# EAGLE design miniDCU (EAGLE 9.6.2)
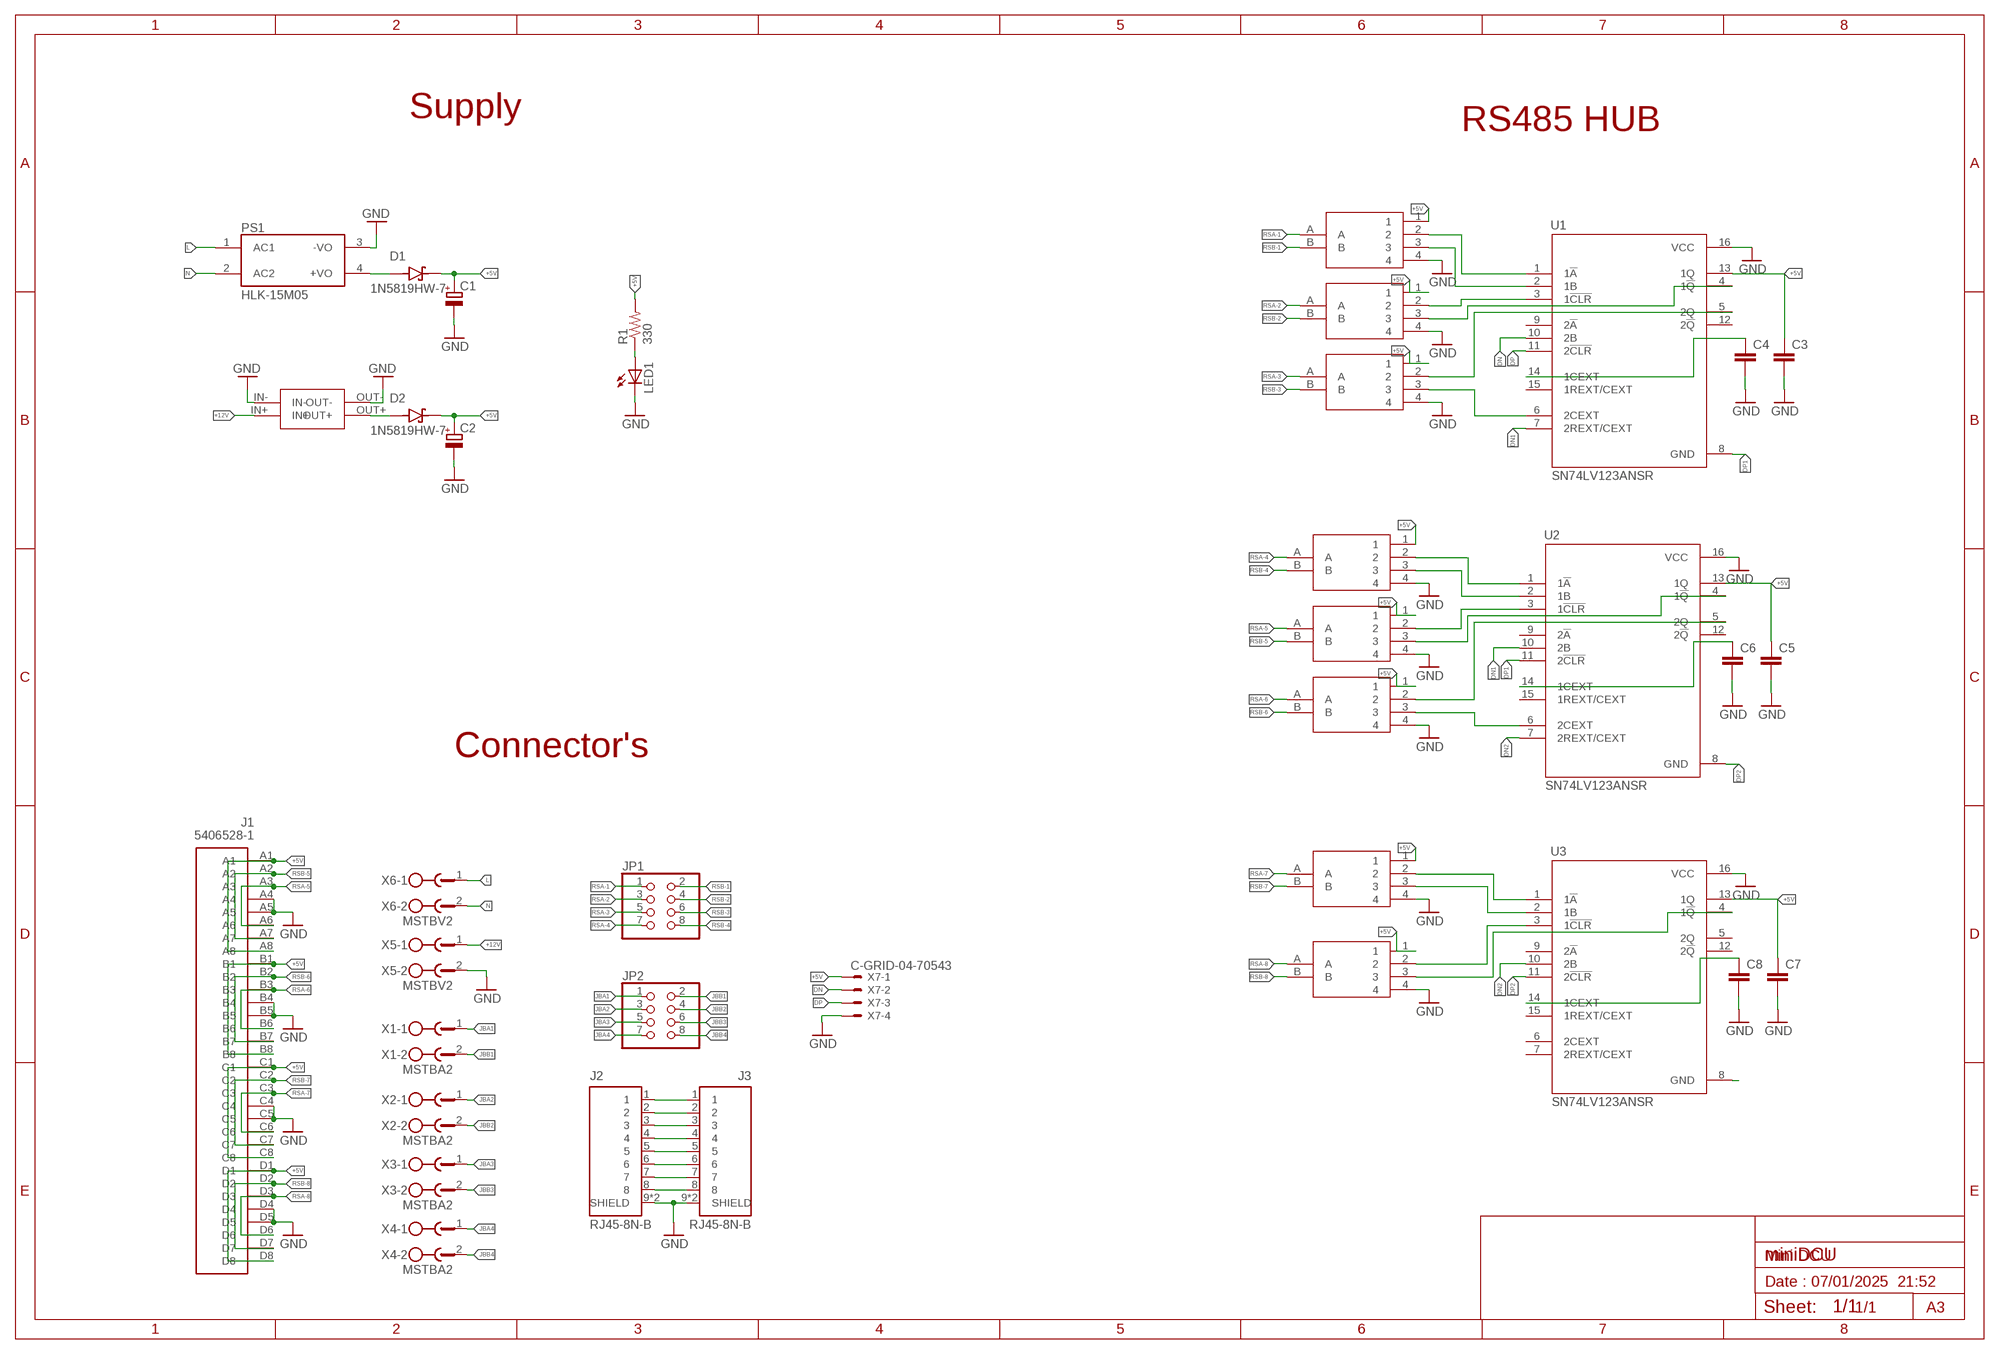
[diagram p0: schematic, sheet 1]

## Parts
C1  CPOL-EU153CLV-0505  [153CLV-0505]
C2  CPOL-EU153CLV-0505  [153CLV-0505]
C3  C-EUC0603K  [C0603K]
C4  C-EUC0603K  [C0603K]
C5  C-EUC0603K  [C0603K]
C6  C-EUC0603K  [C0603K]
C7  C-EUC0603K  [C0603K]
C8  C-EUC0603K  [C0603K]
D1  1N5819HW-7  [SOD3715X145N]
D2  1N5819HW-7  [SOD3715X145N]
J1  5406528-1  [5406528-1]
J2  RJ45-8N-B  [TE_RJ45-8N-B]
J3  RJ45-8N-B  [TE_RJ45-8N-B]
JP1  PINHD-2X4  [2X04]
JP2  PINHD-2X4  [2X04]
LED1  LED3MM  [LED3MM]
MINI1  MINI360  [MINI360]
PS1  HLK-15M05  [CONV_HLK-15M05]
R1  330  R-US_M0805  [M0805]
U1  SN74LV123ANSR  [SOIC127P780X200-16N]
U2  SN74LV123ANSR  [SOIC127P780X200-16N]
U3  SN74LV123ANSR  [SOIC127P780X200-16N]
USB2RS1  USB2RS485  [USB2RS485]
USB2RS2  USB2RS485  [USB2RS485]
USB2RS3  USB2RS485  [USB2RS485]
USB2RS4  USB2RS485  [USB2RS485]
USB2RS5  USB2RS485  [USB2RS485]
USB2RS6  USB2RS485  [USB2RS485]
USB2RS7  USB2RS485  [USB2RS485]
USB2RS8  USB2RS485  [USB2RS485]
X1  MSTBA2  [MSTBA2]
X2  MSTBA2  [MSTBA2]
X3  MSTBA2  [MSTBA2]
X4  MSTBA2  [MSTBA2]
X5  MSTBV2  [MSTBV2]
X6  MSTBV2  [MSTBV2]
X7  C-GRID-04-70543  [70543-04]

## Nets
+5V: C1.+ C2.+ C3.1 C5.1 C7.1 D1.C(K) D2.C(K) J1.A1 J1.A8 J1.B1 J1.B8 J1.C1 J1.C8 J1.D1 J1.D8 R1.2 U1.13(1Q) U2.13(1Q) U3.13(1Q) USB2RS1.1 USB2RS2.1 USB2RS3.1 USB2RS4.1 USB2RS5.1 USB2RS6.1 USB2RS7.1 USB2RS8.1 X7.1
+12V: MINI1.IN+ X5.1
DN: U1.10(2B) X7.2
DN1: U1.7(2REXT/CEXT) U2.10(2B)
DN2: U2.7(2REXT/CEXT) U3.10(2B)
DP: U1.11(2!CLR) X7.3
DP1: U1.8(GND) U2.11(2!CLR)
DP2: U2.8(GND) U3.11(2!CLR)
GND: C1.- C2.- C3.2 C4.2 C5.2 C6.2 C7.2 C8.2 J1.A4 J1.A5 J1.B4 J1.B5 J1.C4 J1.C5 J1.D4 J1.D5 J2.9(SHIELD) J2.10(SHIELD) J3.9(SHIELD) J3.10(SHIELD) LED1.K(C) MINI1.IN- MINI1.OUT- PS1.3(-VO) U1.16(VCC) U2.16(VCC) U3.16(VCC) USB2RS1.4 USB2RS2.4 USB2RS3.4 USB2RS4.4 USB2RS5.4 USB2RS6.4 USB2RS7.4 USB2RS8.4 X5.2 X7.4
JBA1: JP2.1 X1.1
JBA2: JP2.3 X2.1
JBA3: JP2.5 X3.1
JBA4: JP2.7 X4.1
JBB1: JP2.2 X1.2
JBB2: JP2.4 X2.2
JBB3: JP2.6 X3.2
JBB4: JP2.8 X4.2
L: PS1.1(AC1) X6.1
N: PS1.2(AC2) X6.2
N$1: D1.A PS1.4(+VO)
N$2: J2.1 J3.1
N$3: D2.A MINI1.OUT+
N$4: J2.2 J3.2
N$5: J2.3 J3.3
N$6: J2.4 J3.4
N$7: LED1.A R1.1
N$9: J2.5 J3.5
N$10: J2.6 J3.6
N$11: J2.7 J3.7
N$12: J2.8 J3.8
N$13: U3.8(GND)
N$21: U1.1(1!A) USB2RS1.2
N$22: U1.2(1B) USB2RS1.3
N$23: U1.3(1!CLR) USB2RS2.2
N$24: U1.4(1!Q) USB2RS2.3
N$25: U1.5(2Q) USB2RS3.2
N$26: U1.6(2CEXT) USB2RS3.3
N$35: U2.1(1!A) USB2RS5.2
N$36: U2.2(1B) USB2RS5.3
N$37: U2.3(1!CLR) USB2RS6.2
N$38: U2.4(1!Q) USB2RS6.3
N$39: U2.5(2Q) USB2RS7.2
N$40: U2.6(2CEXT) USB2RS7.3
N$49: U3.1(1!A) USB2RS4.2
N$50: U3.2(1B) USB2RS4.3
N$51: U3.3(1!CLR) USB2RS8.2
N$52: U3.4(1!Q) USB2RS8.3
N$54: C4.1 U1.14(1CEXT)
N$55: C8.1 U3.14(1CEXT)
N$61: C6.1 U2.14(1CEXT)
RSA-1: JP1.1 USB2RS1.A
RSA-2: JP1.3 USB2RS2.A
RSA-3: JP1.5 USB2RS3.A
RSA-4: JP1.7 USB2RS5.A
RSA-5: J1.A3 J1.A6 USB2RS6.A
RSA-6: J1.B3 J1.B6 USB2RS7.A
RSA-7: J1.C3 J1.C6 USB2RS4.A
RSA-8: J1.D3 J1.D6 USB2RS8.A
RSB-1: JP1.2 USB2RS1.B
RSB-2: JP1.4 USB2RS2.B
RSB-3: JP1.6 USB2RS3.B
RSB-4: JP1.8 USB2RS5.B
RSB-5: J1.A2 J1.A7 USB2RS6.B
RSB-6: J1.B2 J1.B7 USB2RS7.B
RSB-7: J1.C2 J1.C7 USB2RS4.B
RSB-8: J1.D2 J1.D7 USB2RS8.B
Unconnected: U1.9(2!A) U1.12(2!Q) U1.15(1REXT/CEXT) U2.9(2!A) U2.12(2!Q) U2.15(1REXT/CEXT) U3.5(2Q) U3.6(2CEXT) U3.7(2REXT/CEXT) U3.9(2!A) U3.12(2!Q) U3.15(1REXT/CEXT)

## Notes on the sheet
- Supply
- RS485 HUB
- Connector's
- Mini DCU
- Date : 07/01/2025  21:52
- 1/1 | A3

## Library data of the parts
C1 C2 = rcl:CPOL-EU: POLARIZED CAPACITOR, European symbol; SPICEPREFIX: C
C3-C8 = rcl:C-EU: CAPACITOR, European symbol; SPICEPREFIX: C
D1 D2 = 1N5819HW-7:1N5819HW-7: 1N5819HW Series 40 V 1 A Surface Mount Schottky Barrier Rectifier - SOD-123 Check availability <https://pricing.snapeda.com/parts/1N5819HW-7/Diodes%20Inc./view-part?ref=eda>; AVAILABILITY: In Stock; DESCRIPTION: Diode Schottky 40 V 1A Surface Mount SOD-123; MF: Diodes Inc.; MP: 1N5819HW-7; PACKAGE: SOD-123 Fairchild Semiconductor; PRICE: None; PURCHASE-URL: https://pricing.snapeda.com/search/part/1N5819HW-7/?ref=eda
J1 = 1x4-rj45:5406528-1: https://www.mouser.com/ProductDetail/TE-Connectivity/5406528-1?qs=%2Fha2pyFaduhW1yoX2fqnO8wde0gPlB9ihmIbWroxuIA%3D Check availability <https://pricing.snapeda.com/parts/5406528-1/TE%20Connectivity/view-part?ref=eda>; AVAILABILITY: In Stock; CHECK_PRICES: https://www.snapeda.com/parts/5406528-1/TE+Connectivity+AMP+Connectors/view-part/?ref=eda; COMMENT: 5406528-1; DESCRIPTION: Conn RJ-45 F 32 POS 2.04mm Solder RA Thru-Hole 32 Terminal 4 Port Tray Cat 5; EU_ROHS_COMPLIANCE: Compliant; MF: TE Connectivity; MP: 5406528-1; PACKAGE: None; PRICE: None; SNAPEDA_LINK: https://www.snapeda.com/parts/5406528-1/TE+Connectivity+AMP+Connectors/view-part/?ref=snap
J2 J3 = RJ45-8N-B:RJ45-8N-B: RJ Jack / Signal Line EMI/RFI Filters 6 TERM LOW PROFILE BLOCK INDUCTOR 8 PIN Check availability <https://pricing.snapeda.com/parts/RJ45-8N-B/TE%20Connectivity/view-part?ref=eda>; AVAILABILITY: In Stock; DESCRIPTION: Jack Modular Connector 8p8c (RJ45, Ethernet) 90° Angle (Right) Unshielded -; MF: TE Connectivity; MP: RJ45-8N-B; PACKAGE: None; PRICE: None; PURCHASE-URL: https://pricing.snapeda.com/search/part/RJ45-8N-B/?ref=eda
JP1 JP2 = pinhead:PINHD-2X4: PIN HEADER
LED1 = adafruit:LED: LED OSRAM: - CHIPLED LG R971, LG N971, LY N971, LG Q971, LY Q971, LO R971, LY R971 LH N974, LH R974 LS Q976, LO Q976, LY Q976 LO Q996 - Hyper CHIPLED LW Q18S LB Q993, LB Q99A, LB R99A - SideLED LS A670, LO A670, LY A670, LG A670, LP A670 LB A673, LV A673, LT A673, LW A673 LH A674 LY A675 LS A676, LA A676, LO A676, LY A676, LW A676 LS A679, LY A679, LG A679 - Hyper Micro SIDELED® LS Y876, LA Y876, LO Y876, LY Y876 LT Y87S - SmartLED LW L88C, LW L88S LB L89C, LB L89S, LG L890 LS L89K, LO L89K, LY L89K LS L896, LA L896, LO L896, LY L896 - TOPLED LS T670, LO T670, LY T670, LG T670, LP T670 LSG T670, LSP T670, LSY T670, LOP T670, LYG T670 LG T671, LOG T671, LSG T671 LB T673, LV T673, LT T673, LW T673 LH T674 LS T676, LA T676, LO T676, LY T676, LB T676, LH T676, LSB T676, LW T676 LB T67C, LV T67C, LT T67C, LS T67K, LO T67K, LY T67K, LW E67C LS E67B, LA E67B, LO E67B, LY E67B, LB E67C, LV E67C, LT E67C LW T67C LS T679, LY T679, LG T679 LS T770, LO T770, LY T770, LG T770, LP T770 LB T773, LV T773, LT T773, LW T773 LH T774 LS E675, LA E675, LY E675, LS T675 LS T776, LA T776, LO T776, LY T776, LB T776 LHGB T686 LT T68C, LB T68C - Hyper Mini TOPLED® LB M676 - Mini TOPLED Santana® LG M470 LS M47K, LO M47K, LY M47K Source: http://www.osram.convergy.de/
MINI1 = mini360:MINI360
PS1 = HLK-15M05:HLK-15M05: Check availability <https://pricing.snapeda.com/parts/HLK-10M12/Hi-link/view-part?ref=eda>; AVAILABILITY: Not in stock; CHECK_PRICES: https://www.snapeda.com/parts/HLK-10M12/Hi-link/view-part/?ref=eda; DESCRIPTION: 10W Ultra-Compact Power Module; MF: Hi-link; MP: HLK-10M12; PACKAGE: Package; PRICE: None; SNAPEDA_LINK: https://www.snapeda.com/parts/HLK-10M12/Hi-link/view-part/?ref=snap
R1 = adafruit:R-US_: RESISTOR, American symbol
U1-U3 = SN74LV123ANSR:SN74LV123ANSR: Monostable Multivibrator 13ns 16-SO; CHECK_PRICES: https://www.snapeda.com/parts/SN74LV123ANSR/Texas+Instruments/view-part/?ref=eda; DESCRIPTION: Dual Retriggerable Monostable Multivibrators; DIGIKEY_PART_NUMBER: 296-46201-2-ND; MF: Texas Instruments; MP: SN74LV123ANSR; PACKAGE: SOP-16 Texas Instruments; SNAPEDA_LINK: https://www.snapeda.com/parts/SN74LV123ANSR/Texas+Instruments/view-part/?ref=snap
USB2RS1-USB2RS8 = USB2RS485:USB2RS485
X1-X4 = con-phoenix-508:MSTBA2: PHOENIX; MF: FARNELL; MPN: 1757242; OC_FARNELL: 3705171; OC_NEWARK: 71C4161
X5 X6 = con-phoenix-508:MSTBV2: PHOENIX
X7 = con-molex:C-GRID-04: CONNECTOR wire to board 2.54 mm (0.100") pitch header; MF: MOLEX; OC_FARNELL: unknown; OC_NEWARK: unknown

## Board
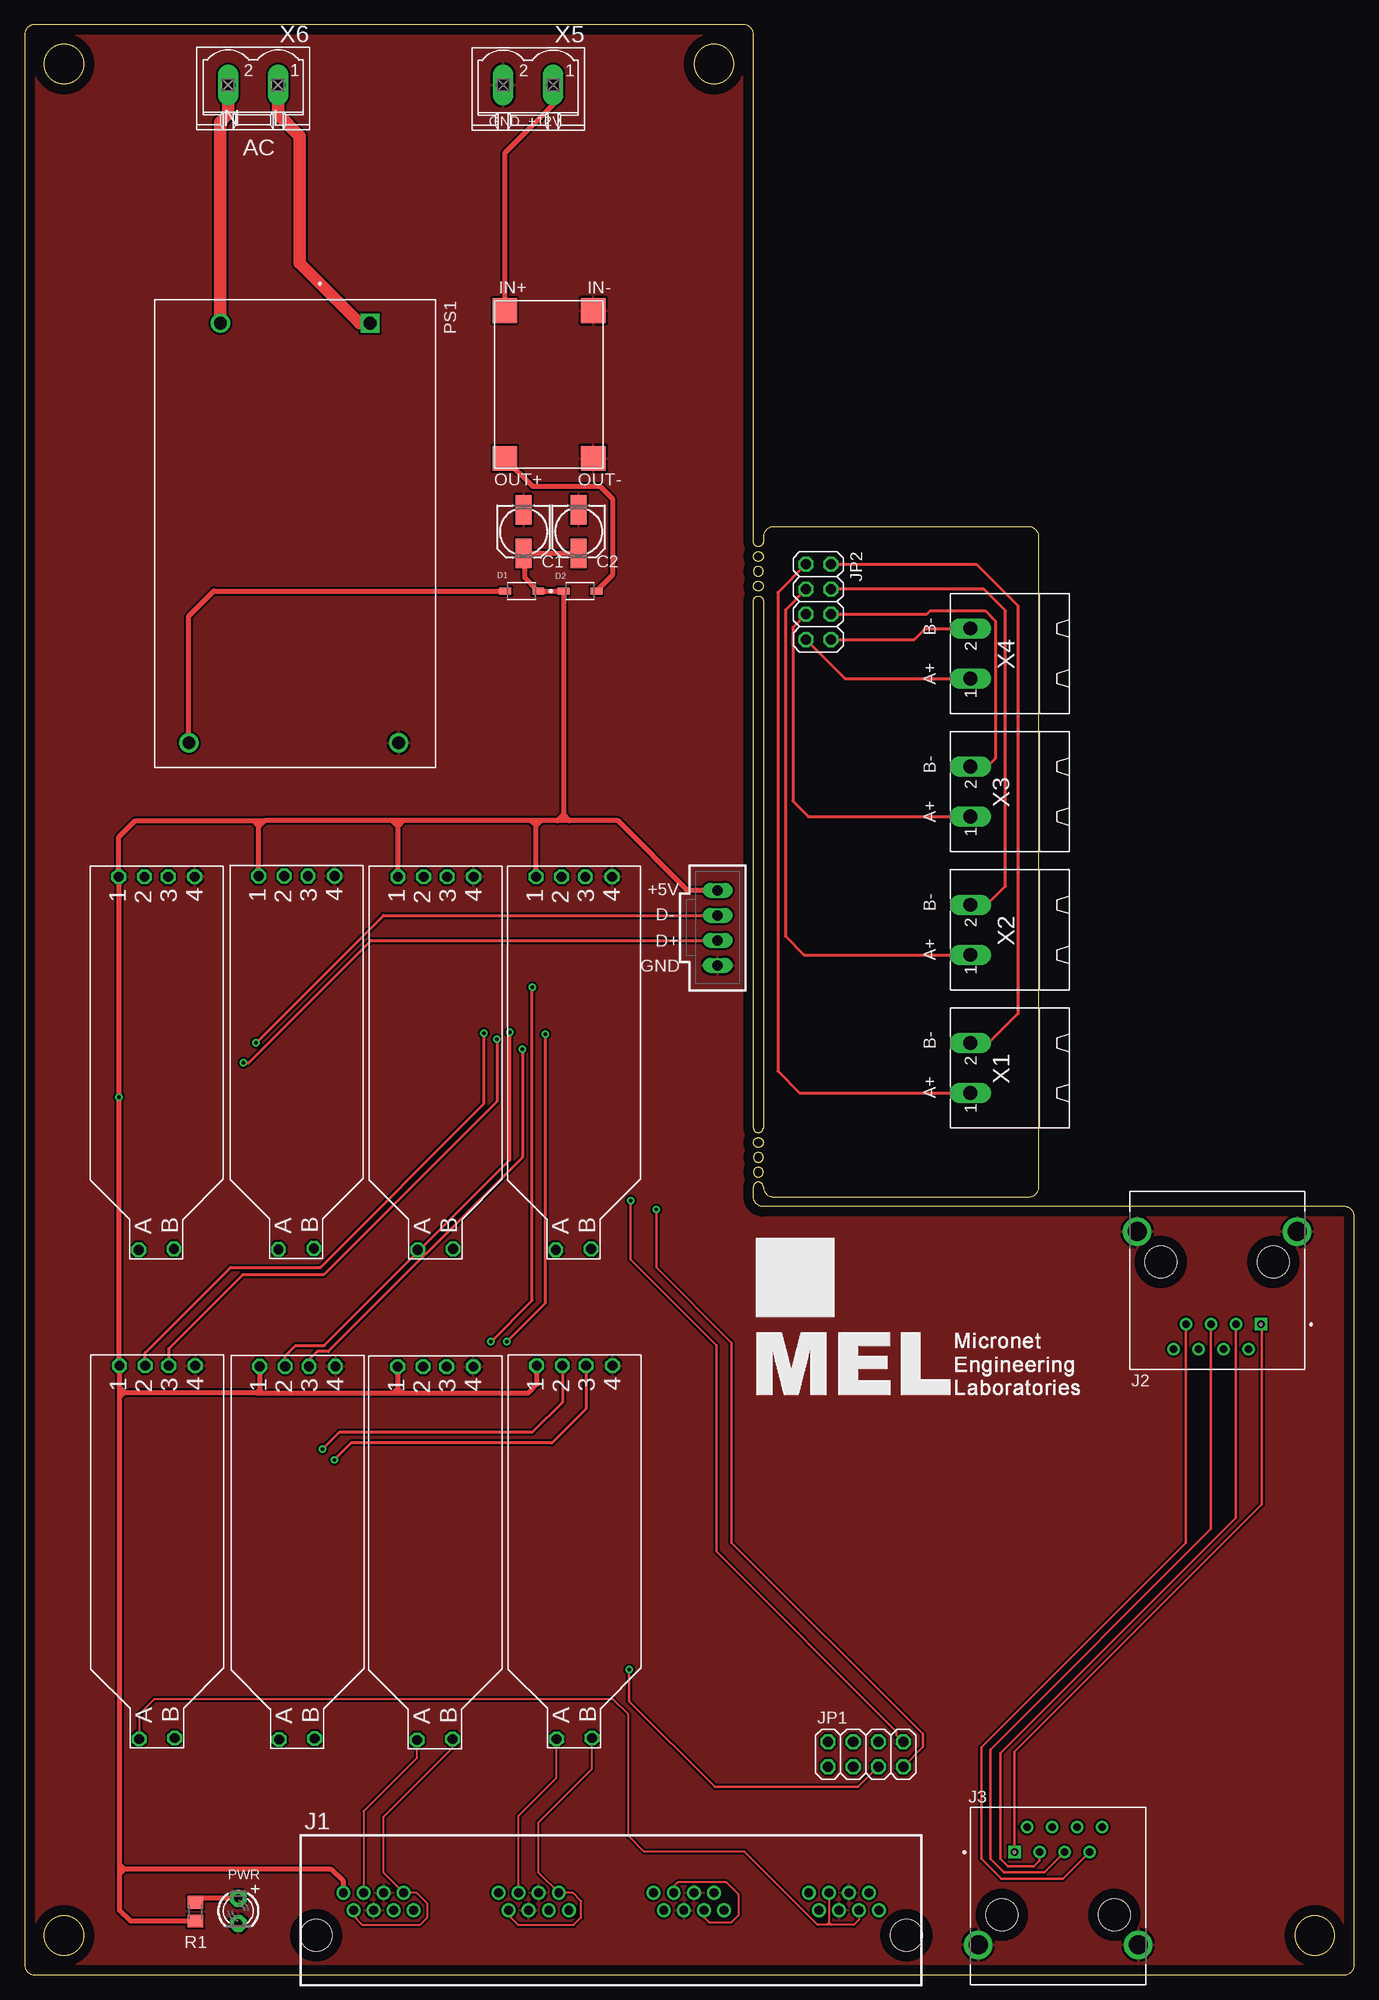
[diagram p1: board, top side]
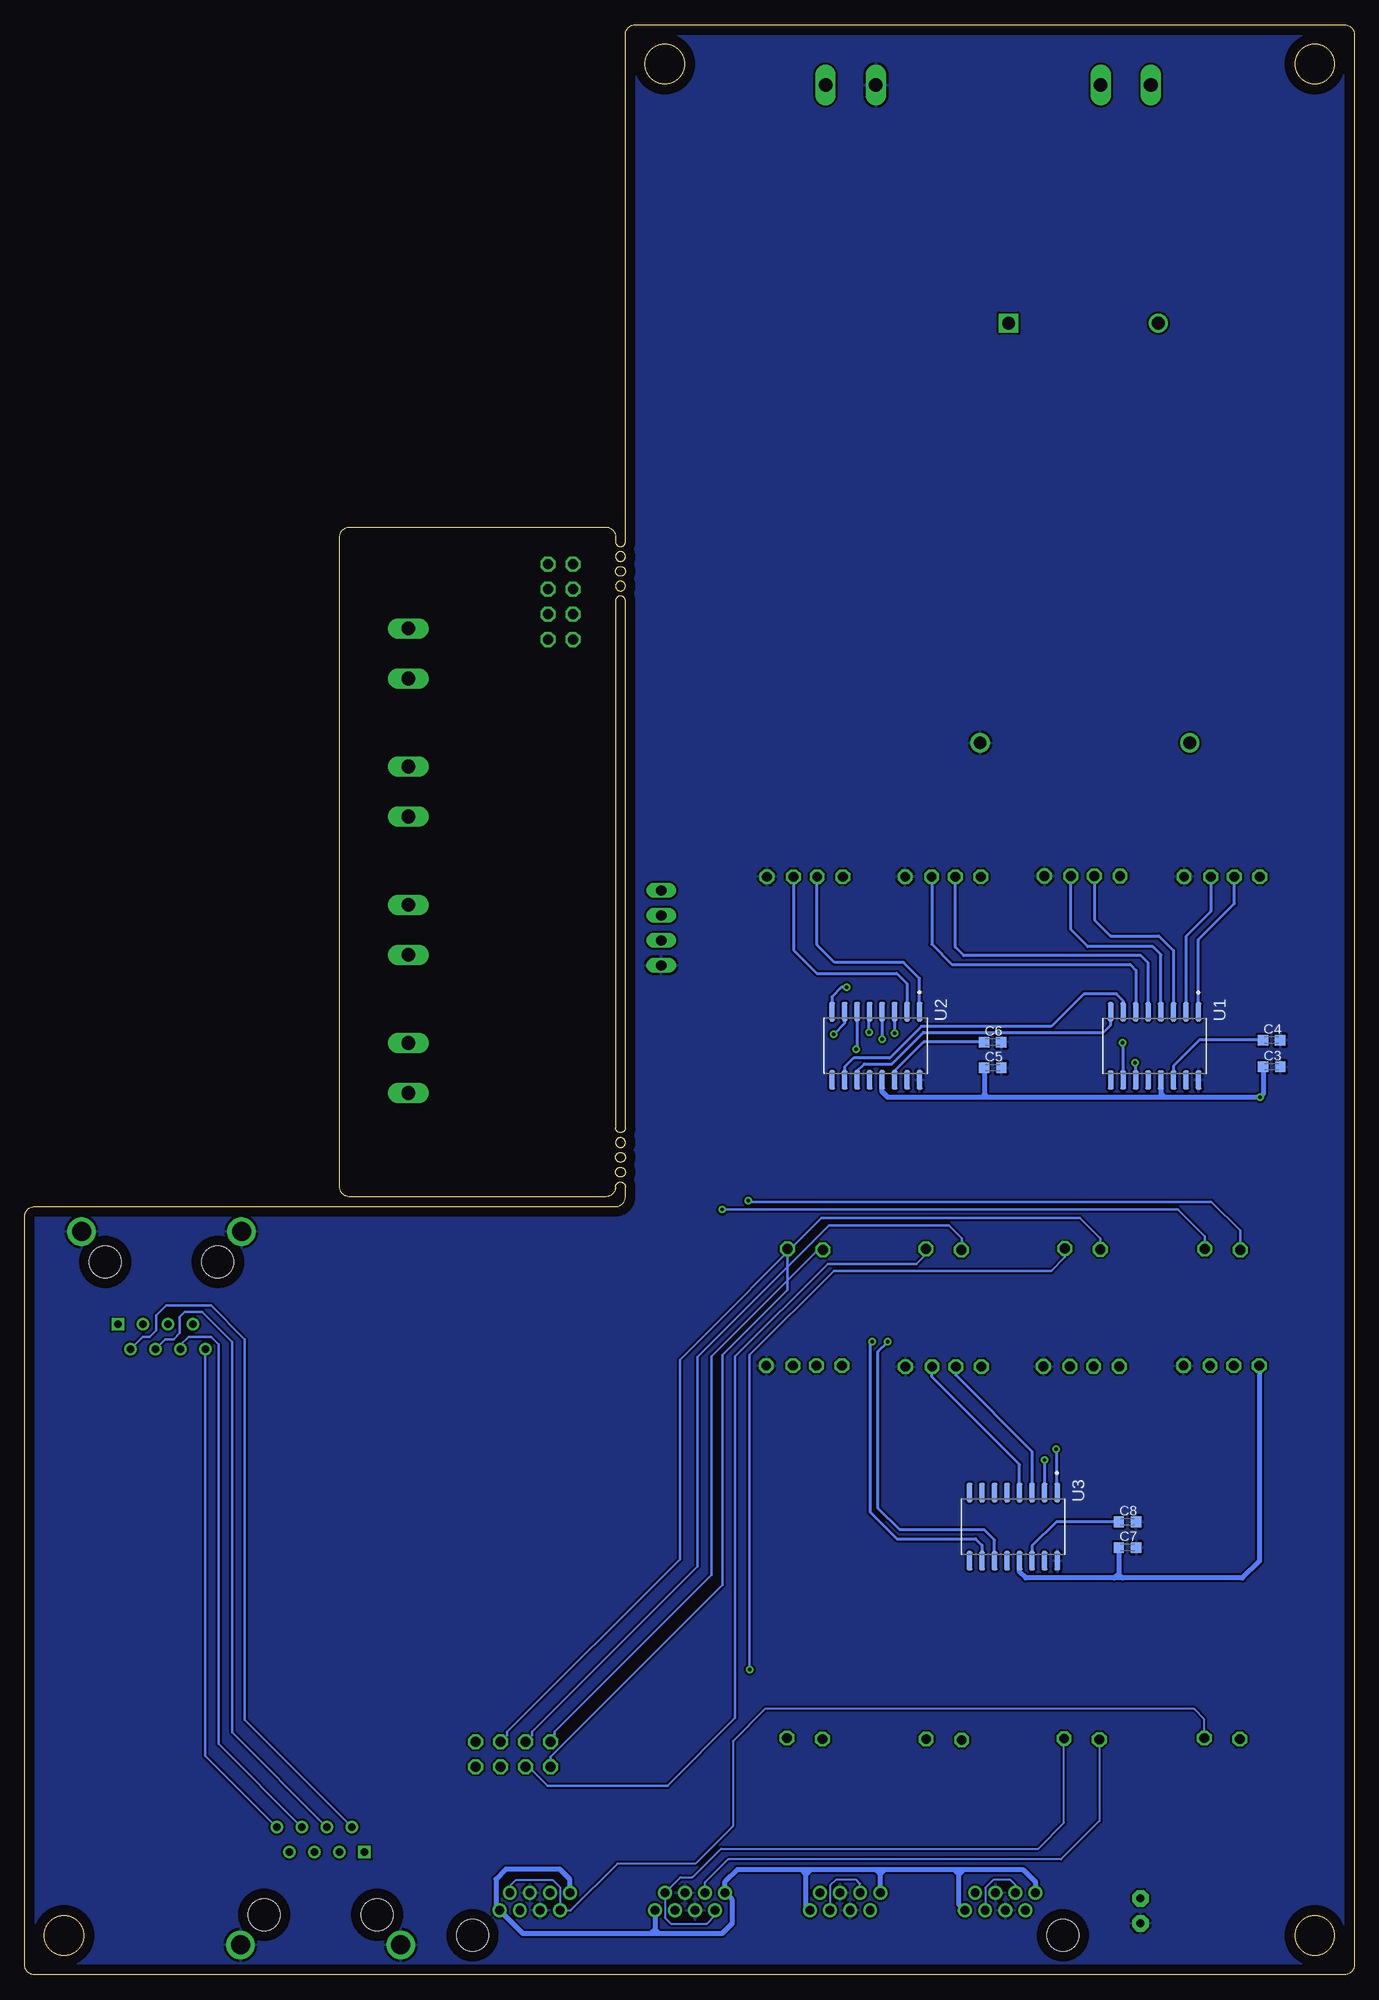
[diagram p2: board, bottom side, seen from below]

Size 135 x 198 mm. Coordinates in mm from the lower left corner, seen from the top.
Outline: 1,0 134,0 arc90 135,1 135,77 arc90 134,78 75,78 arc-90 74,79 74,80 arc-90 74.5,80.5 arc-90 75,80 arc90 76,79 102,79 arc90 103,80 103,146 arc90 102,147 76,147 arc90 75,146 75,145.5 arc-90 74.5,145 arc-90 74,145.5 74,197 arc90 73,198 1,198 arc90 0,197 0,1 arc90 1,0
Outline: 74,86 74,139.5 arc-90 74.5,140 arc-90 75,139.5 75,86 arc-90 74.5,85.5 arc-90 74,86
Outline: 74,144 arc-90 74.5,144.5 arc-90 75,144 arc-90 74.5,143.5 arc-90 74,144
Outline: 74.5,143 arc90 74,142.5 arc90 74.5,142 arc90 75,142.5 arc90 74.5,143
Outline: 74,141 arc-90 74.5,141.5 arc-90 75,141 arc-90 74.5,140.5 arc-90 74,141
Outline: 74,81.5 arc90 74.5,81 arc90 75,81.5 arc90 74.5,82 arc90 74,81.5
Outline: 74,83 arc90 74.5,82.5 arc90 75,83 arc90 74.5,83.5 arc90 74,83
Outline: 75,84.5 arc-90 74.5,84 arc-90 74,84.5 arc-90 74.5,85 arc-90 75,84.5
Outline: circle at 131,4 radius 2
Outline: circle at 4,4 radius 2
Outline: circle at 4,194 radius 2
Outline: circle at 70,194 radius 2
Copper layers (1*16): Top 0.035mm / dielectric 1.5mm / Bottom 0.035mm
Design rules "default *": minimum track width 6mil, minimum drill 0.35mm, track to track 8mil, track to pad 8mil, pad to pad 6mil, via to via 6mil, smd to smd 6mil, copper to edge 40mil, drill to drill 6mil, minimum pad ring 10mil, minimum via ring 8mil, stop-mask expansion 4mil, vias tented up to drill 0mil, thermal gap 10mil

### Footprints (pad centres in the part's own frame; a part is rotated, then mirrored left to right if it is on the bottom)
153CLV-0505 = smd 3 x 1.6: + 2.2,0; - -2.2,0
C0603K = smd 1.05 x 1.08: 1 -0.875,0; 2 0.875,0
SOD3715X145N = smd 1.21 x 0.73: A 1.68,0; C -1.68,0
5406528-1 = drill 0.9 pad 1.3: A1 27.21,7.62; A2 26.19,9.4; A3 25.17,7.62; A4 24.15,9.4; A5 23.13,7.62; A6 22.11,9.4; A7 21.09,7.62; A8 20.07,9.4; B1 11.46,7.62; B2 10.44,9.4; B3 9.42,7.62; B4 8.4,9.4; B5 7.38,7.62; B6 6.36,9.4; B7 5.34,7.62; B8 4.32,9.4; C1 -4.29,7.62; C2 -5.31,9.4; C3 -6.33,7.62; C4 -7.35,9.4; C5 -8.37,7.62; C6 -9.39,9.4; C7 -10.41,7.62; C8 -11.43,9.4; D1 -20.04,7.62; D2 -21.06,9.4; D3 -22.08,7.62; D4 -23.1,9.4; D5 -24.12,7.62; D6 -25.14,9.4; D7 -26.16,7.62; D8 -27.18,9.4 | hole 3.25: -29.97,5.08; 29.97,5.08
TE_RJ45-8N-B = drill 0.76 square: 1 -4.445,6.35 | drill 0.76: 2 -3.175,8.89; 3 -1.905,6.35; 4 -0.635,8.89; 5 0.635,6.35; 6 1.905,8.89; 7 3.175,6.35; 8 4.445,8.89 | drill 1.93: 9 -8.125,-3.05; 10 8.125,-3.05 | hole 3.25: -5.715,0; 5.715,0
2X04 = drill 1.016 octagon: 1 -3.81,-1.27; 2 -3.81,1.27; 3 -1.27,-1.27; 4 -1.27,1.27; 5 1.27,-1.27; 6 1.27,1.27; 7 3.81,-1.27; 8 3.81,1.27
LED3MM = drill 0.813 pad 1.676 octagon: A -1.27,0; K 1.27,0
MINI360 = smd 2.5 x 2.5: IN+ 1,1; IN- 1,10; OUT+ 16,1; OUT- 16,10
CONV_HLK-15M05 = drill 1.3 square: 1 -21.35,7.6 | drill 1.3: 2 -21.35,-7.6; 3 21.25,10.5; 4 21.25,-10.8
M0805 = smd 1.3 x 1.6: 1 -0.95,0; 2 0.95,0
SOIC127P780X200-16N = smd 1.97 x 0.61: 1 -3.465,4.445; 2 -3.465,3.175; 3 -3.465,1.905; 4 -3.465,0.635; 5 -3.465,-0.635; 6 -3.465,-1.905; 7 -3.465,-3.175; 8 -3.465,-4.445; 9 3.465,-4.445; 10 3.465,-3.175; 11 3.465,-1.905; 12 3.465,-0.635; 13 3.465,0.635; 14 3.465,1.905; 15 3.465,3.175; 16 3.465,4.445
USB2RS485 = drill 1 pad 1.422 octagon: 1 36.9,3.6; 2 36.9,1; 3 36.9,-1.4; 4 36.9,-4.1; A -1,1.6; B -0.9,-2
MSTBA2 = drill 1.397 long: 1 -2.54,5.08; 2 2.54,5.08
MSTBV2 = drill 1.397 long: 1 -2.54,0; 2 2.54,0
70543-04 = drill 1.016 long: 1 -3.81,0; 2 -1.27,0; 3 1.27,0; 4 3.81,0

### Placement (x,y rotation side)
C1  50.65,146.52 270 top
C2  56.25,146.54 270 top
C3  8.38,92.2 0 bottom
C4  8.39,94.9 0 bottom
C5  36.7,92.1 0 bottom
C6  36.71,94.7 0 bottom
C7  23.02,43.4 0 bottom
C8  23.03,46 0 bottom
D1  50.48,140.49 180 top
D2  56.38,140.49 0 top
J1  59.55,-1.07 0 top
J2  121.09,72.41 180 top
J3  104.95,6.11 0 top
JP1  85.4,22.4 180 top
JP2  80.6,139.4 270 top
LED1  21.7,6.5 270 top
MINI1  47.74,169.96 270 top
PS1  27.48,146.33 270 top
R1  17.34,6.43 270 top
U1  20.27,94.32 270 bottom
U2  48.57,94.33 270 bottom
U3  34.61,45.52 270 bottom
USB2RS1  13.17,74.59 90 top
USB2RS2  27.37,74.65 90 top
USB2RS3  41.5,74.59 90 top
USB2RS4  55.6,24.95 90 top
USB2RS5  55.53,74.59 90 top
USB2RS6  13.23,24.95 90 top
USB2RS7  27.46,24.89 90 top
USB2RS8  41.46,24.85 90 top
X1  101.11,92.07 90 top
X2  101.11,106.1 90 top
X3  101.11,120.13 90 top
X4  101.11,134.16 90 top
X5  51.13,191.87 180 top
X6  23.2,191.88 180 top
X7  70.36,106.3 270 top

### Tracks (layer width: path | path; a pad name or v marks a point on that pad's centre or on a via)
+5V  (via drill 0.35)
  Top 0.508: C1.+ 50.8,144.32 | 50.8,144.32 56.23,144.32 C2.+ | 52.45,117.19 51.44,117.19 | 51.44,117.19 38.45,117.19 | 38.45,117.19 37.34,117.19 | 37.34,117.19 24.35,117.19 | 23.24,117.19 11.25,117.19 9.57,115.51 USB2RS1.1 v9.57,89.09 9.57,61.91 USB2RS6.1 | 23.24,117.19 24.35,117.19 | USB2RS2.1 23.77,116.61 | 24.35,117.19 23.77,116.61 | USB2RS3.1 37.9,116.64 | 38.45,117.19 37.9,116.64 | USB2RS6.1 9.63,59.64 10.19,59.09 | 23.55,59.09 10.19,59.09 | 23.55,59.09 24.13,59.09 | 24.13,59.09 37.45,59.09 | 37.45,59.09 38.27,59.09 | 38.27,59.09 51.15,59.09 52.05,59.99 52.05,61.8 USB2RS4.1 | USB2RS8.1 37.86,59.5 | 37.86,59.5 37.45,59.09 | USB2RS7.1 23.86,59.4 | 23.55,59.09 23.86,59.4 | USB2RS6.1 9.63,58.64 | 9.63,58.64 9.63,11.22 | 9.63,11.22 9.63,10.22 | 9.63,10.22 9.63,6.6 10.76,5.48 R1.2 | 50.8,144.32 50.8,141.85 D1.C 54.6,140.49 54.65,140.54 D2.C 54.7,117.78 | X7.1 67.31,110.11 60.23,117.19 55.3,117.19 | 55.3,117.19 54.1,117.19 | 54.1,117.19 52.45,117.19 | USB2RS5.1 51.93,116.66 | 52.45,117.19 51.93,116.66 | 54.7,117.78 54.1,117.19 | 54.7,117.78 55.3,117.19 | 51.93,116.66 51.44,117.16 51.44,117.19 | 37.9,116.64 37.89,116.64 37.34,117.19 | 23.77,116.61 23.77,116.66 23.24,117.19 | 10.19,59.09 10.07,59.09 9.63,58.64 | 23.86,59.4 23.86,59.36 24.13,59.09 | 37.86,59.5 38.27,59.09 | J1.D8 32.37,9.49 31.14,10.72 10.13,10.72 | 9.63,10.22 10.13,10.72 | 10.13,10.72 9.63,11.22
  Bottom 0.508: C7.1 23.89,40.79 | 24.39,40.29 23.89,40.79 | 24.39,40.29 33.35,40.29 33.97,40.91 U3.13 | USB2RS6.1 9.63,42.01 11.35,40.29 23.5,40.29 | 23.5,40.29 24.39,40.29 | C3.1 9.25,89.4 v9.57,89.09 19.25,89.09 | U1.13 19.63,89.47 19.25,89.09 | 19.25,89.09 37.25,89.09 | 37.25,89.09 47.35,89.09 47.93,89.67 U2.13 | C5.1 37.57,89.41 37.25,89.09 | 23.89,40.79 23.89,40.68 23.5,40.29 | 47.64,10.72 40.64,10.72 | 40.64,10.72 39.64,10.72 | 39.64,10.72 33.64,10.72 32.37,9.45 J1.D8 | 56.14,10.72 62.64,10.72 63.87,9.49 J1.B8 63.14,7.6 63.14,5.22 64.14,4.22 70.64,4.22 | 56.14,10.72 55.14,10.72 | 55.14,10.72 48.64,10.72 | 48.64,10.72 47.64,10.72 | J1.C8 48.12,10.24 | 47.64,10.72 48.12,10.24 | 48.12,10.24 48.16,10.24 48.64,10.72 | 71.38,4.22 84.43,4.22 J1.A1 87.14,6.93 87.14,9.73 86.14,10.73 80.64,10.73 79.62,9.7 J1.A8 | 71.38,4.22 70.64,4.22 | J1.B1 71.01,4.59 | 71.01,4.59 70.64,4.22 | 71.01,4.59 71.38,4.22 | J1.C1 55.64,6.93 55.64,10.22 | 55.64,10.22 55.14,10.72 | 55.64,10.22 56.14,10.72 | J1.D1 40.14,7.18 40.14,10.22 | 40.14,10.22 39.64,10.72 | 40.14,10.22 40.64,10.72
+12V
  Top 0.508: X5.1 53.67,189.87 48.74,184.94 MINI1.IN+
DN  (via drill 0.35)
  Top 0.305: v23.5,94.61 36.45,107.57 X7.2
  Bottom 0.305: U1.10 23.44,94.56 v23.5,94.61
DN1
  Bottom 0.305: U1.7 23.44,98.88 24.15,99.59 27.45,99.59 30.75,96.29 43.95,96.29 47.15,93.09 50.85,93.09 51.75,92.19 U2.10
DN2  (via drill 0.35)
  Top 0.305: v52.85,95.49 52.85,68.19 v48.95,64.29
  Bottom 0.305: U3.10 37.78,43.62 38.45,44.29 46.45,44.29 49.15,46.99 49.15,64.09 v48.95,64.29 | U2.7 51.74,96.59 v52.85,95.49
DP  (via drill 0.35)
  Top 0.305: v22.23,92.58 22.73,92.58 35.18,105.03 X7.3
  Bottom 0.305: U1.11 22.17,92.53 v22.23,92.58
DP1
  Bottom 0.305: U2.11 50.47,91.76 49.75,92.49 46.95,92.49 43.75,95.69 25.45,95.69 24.71,96.42 U1.8
DP2  (via drill 0.35)
  Top 0.305: v47.35,64.29 51.55,68.49 v51.55,100.29
  Bottom 0.305: U3.11 36.51,44.15 37.55,45.19 46.15,45.19 48.35,47.39 48.35,63.29 v47.35,64.29 | v51.55,100.29 52.05,100.29 53.05,99.29 53.05,97.83 U2.8
GND
  pour Top: 1,0 arc-90 0,1 0,197 arc-90 1,198 74,198 74,79 arc90 75,78 134,78 arc-90 135,77 135,1 arc-90 134,0
  pour Bottom: 1,0 arc-90 0,1 0,197 arc-90 1,198 74,198 74,79 arc90 75,78 134,78 arc-90 135,77 135,1 arc-90 134,0
JBA1
  Top 0.305: JP2.1 76.47,140.35 76.47,91.75 78.69,89.53 X1.1
JBA2
  Top 0.305: JP2.3 77.23,138.57 77.23,105.46 79.14,103.56 X2.1
JBA3
  Top 0.305: JP2.5 77.99,136.79 77.99,119.18 79.58,117.59 X3.1
JBA4
  Top 0.305: JP2.7 83.3,131.62 X4.1
JBB1
  Top 0.305: JP2.2 96.64,143.21 100.85,138.99 100.85,97.59 97.87,94.61 X1.2
JBB2
  Top 0.305: X2.2 97.68,108.64 99.58,110.54 99.58,138.48 97.4,140.67 JP2.4
JBB3
  Top 0.305: JP2.6 91.61,138.13 91.96,138.48 97.55,138.48 98.57,137.47 98.57,123.5 97.74,122.67 X3.2
JBB4
  Top 0.305: JP2.8 90.34,135.59 91.45,136.7 X4.2
L
  Top 1.27: X6.1 25.74,188.88 27.94,186.68 27.94,173.76 34.02,167.68 PS1.1
N
  Top 1.27: PS1.2 19.88,188.1 20.66,188.88 X6.2
N$1
  Top 0.508: PS1.4 16.68,137.96 19.21,140.49 D1.A
N$2
  Top 0.254: J3.1 100.5,22.65 125.6,47.75 125.6,65.99 J2.1
N$3
  Top 0.508: MINI1.OUT+ 51.57,151.13 58.42,151.13 59.69,149.86 59.69,142.12 D2.A
N$4
  Bottom 0.254: J3.2 112.65,25.87 112.65,64.52 116.08,67.94 120.65,67.94 121.67,66.93 121.67,65.4 122.3,64.77 123.01,64.77 J2.2
N$5
  Top 0.254: J2.3 123,46.41 99.06,22.48 99.06,11.81 99.82,11.05 102.49,11.05 103.04,11.6 J3.3
N$6
  Bottom 0.254: J2.4 120.72,64.52 119.89,64.52 119.25,65.15 119.25,66.8 118.75,67.31 116.97,67.31 113.92,64.26 113.92,24.6 J3.4
N$7
  Top 0.508: R1.1 17.72,7.76 LED1.A
N$9
  Top 0.254: J3.5 103.54,10.41 99.44,10.41 98.04,11.81 98.04,22.86 120.46,45.27 J2.5
N$10
  Bottom 0.254: J3.6 115.32,23.46 115.32,64.01 116.08,64.77 118.36,64.77 119.19,63.95 J2.6
N$11
  Top 0.254: J2.7 117.92,43.87 97.16,23.11 97.16,11.81 99.19,9.78 105.44,9.78 J3.7
N$12
  Bottom 0.254: J3.8 116.65,22.25 J2.8
N$21
  Bottom 0.305: U1.1 15.82,105.11 12.17,108.77 USB2RS1.2
N$22
  Bottom 0.305: USB2RS1.3 14.57,107.97 17.09,105.44 U1.2
N$23
  Bottom 0.305: USB2RS2.2 26.37,107.11 24.75,105.49 19.85,105.49 18.36,104 U1.3
N$24
  Bottom 0.305: U1.4 19.63,103.57 20.45,104.39 27.05,104.39 28.77,106.11 USB2RS2.3
N$25
  Bottom 0.305: U1.5 20.9,102.74 21.65,103.49 39.65,103.49 40.5,104.34 USB2RS3.2
N$26
  Bottom 0.305: USB2RS3.3 42.9,104.64 40.85,102.59 22.75,102.59 22.15,101.99 22.15,97.81 U1.6
N$35
  Bottom 0.305: U2.1 44.12,101.16 45.75,102.79 52.75,102.79 54.53,104.57 USB2RS5.2
N$36
  Bottom 0.305: USB2RS5.3 56.93,104.07 54.55,101.69 46.45,101.69 45.39,100.63 U2.2
N$37  (via drill 0.35)
  Top 0.305: USB2RS6.2 12.23,63.17 20.9,71.84 30.03,71.84 46.65,88.46 v46.65,95.59
  Bottom 0.305: v46.65,95.59 46.65,97.78 U2.3
N$38  (via drill 0.35)
  Top 0.305: v47.95,94.99 47.95,88.66 30.35,71.07 22.13,71.07 14.63,63.57 USB2RS6.3
  Bottom 0.305: U2.4 47.93,95 v47.95,94.99
N$39  (via drill 0.35)
  Top 0.305: USB2RS7.2 26.46,62.84 27.5,63.89 30.42,63.89 49.25,82.71 v49.25,95.69
  Bottom 0.305: v49.25,95.69 49.25,97.75 U2.5
N$40  (via drill 0.35)
  Top 0.305: v50.55,93.99 50.55,83.01 30.82,63.29 29.7,63.29 28.85,62.43 28.85,61.8 USB2RS7.3
  Bottom 0.305: U2.6 50.47,94.06 v50.55,93.99
N$49  (via drill 0.35)
  Top 0.305: USB2RS4.2 54.6,58.14 51.55,55.09 31.95,55.09 v30.25,53.39
  Bottom 0.305: v30.25,53.39 30.25,49.07 U3.1
N$50  (via drill 0.35)
  Top 0.305: USB2RS4.3 57,57.44 53.55,53.99 33.15,53.99 v31.45,52.29
  Bottom 0.305: v31.45,52.29 31.45,49 U3.2
N$51
  Bottom 0.305: USB2RS8.2 40.46,60.9 32.7,53.14 U3.3
N$52
  Bottom 0.305: U3.4 33.97,51.81 42.86,60.7 USB2RS8.3
N$54
  Bottom 0.305: C4.1 15.74,94.9 18.36,92.27 U1.14
N$55
  Bottom 0.305: C8.1 30.24,46 32.7,43.53 U3.14
N$61
  Bottom 0.305: C6.1 43.74,94.7 46.66,91.77 U2.14
RSA-1  (via drill 0.35)
  Top 0.254: JP1.1 88.54,24.34 88.54,24.67 70.23,42.99 70.23,63.92 61.53,72.62 v61.53,78.62
  Bottom 0.254: v61.53,78.62 61.4,78.49 14.49,78.49 11.57,75.57 USB2RS1.A
RSA-2
  Bottom 0.254: USB2RS2.A 25.77,74.75 27.86,76.83 54.07,76.83 68.48,62.42 68.48,42.2 86,24.67 86,24.34 JP1.3
RSA-3
  Bottom 0.254: JP1.5 83.46,24.34 83.46,24.67 66.67,41.46 66.67,62.76 53.34,76.09 41.15,76.09 39.85,74.79 39.85,73.64 USB2RS3.A
RSA-4
  Bottom 0.254: USB2RS5.A 53.93,74.11 65.25,62.79 65.25,40.62 81.2,24.67 81.2,24.06 JP1.7
RSA-5
  Top 0.2: USB2RS6.A 11.63,26.47 13.15,27.99 59.75,27.99 61.3,26.43 61.3,14.1 62.9,12.5 73.1,12.5 80.52,5.08 81.42,5.08 | J1.A3 84.72,5.6 84.2,5.08 81.9,5.08 | 81.9,5.08 81.42,5.08 | J1.A6 81.66,5.32 | 81.66,5.32 81.42,5.08 | 81.66,5.32 81.9,5.08
RSA-6
  Top 0.2: J1.B3 68.97,5.83 69.47,5.33 71.76,5.33 72.52,6.1 72.52,8.13 71.25,9.4 66.29,9.4 65.91,9.01 J1.B6
  Bottom 0.2: USB2RS7.A 25.86,15.64 29.78,11.72 63.58,11.72 65.91,9.39 J1.B6
RSA-7
  Top 0.2: USB2RS4.A 54,20 50.16,16.16 J1.C6
  Bottom 0.2: J1.C6 50.16,9.27 50.55,9.65 52.64,9.65 53.22,9.07 J1.C3
RSA-8
  Top 0.2: USB2RS8.A 39.86,22.06 34.41,16.61 J1.D6
  Bottom 0.2: J1.D6 34.41,9.14 34.93,9.65 36.64,9.65 37.47,8.82 J1.D3
RSB-1  (via drill 0.35)
  Top 0.254: JP1.2 91.21,23.13 91.21,24.46 71.79,43.88 71.79,64.17 64.14,71.82 v64.14,77.71
  Bottom 0.254: v64.14,77.71 17.89,77.71 15.17,74.99 USB2RS1.B
RSB-2  (via drill 0.35)
  Top 0.254: JP1.4 86.63,21.13 84.6,19.1 70.08,19.1 61.39,27.79 v61.39,30.99
  Bottom 0.254: USB2RS2.B 29.37,72.87 30.75,71.49 52.85,71.49 61.39,62.94 v61.39,30.99
RSB-3
  Bottom 0.254: JP1.6 83.83,21.13 81.9,19.2 69.73,19.2 62.85,26.09 62.85,62.79 53.45,72.19 44.45,72.19 43.5,73.14 USB2RS3.B
RSB-4
  Bottom 0.254: JP1.8 81.59,22.13 64.15,39.57 64.15,62.92 57.53,69.54 USB2RS5.B
RSB-5
  Bottom 0.2: USB2RS6.B 15.23,25.97 16.25,26.99 59.85,26.99 63.1,23.73 63.1,15.1 66.9,11.3 74.8,11.3 79.55,6.55 J1.A7 80.65,6.56 80.65,8.91 81.4,9.65 85.09,9.65 85.74,9 J1.A2
RSB-6
  Bottom 0.2: USB2RS7.B 29.46,15.44 32.08,12.82 64.28,12.82 67.19,9.91 68.41,9.91 J1.B2 69.99,5.81 69.39,5.21 65.73,5.21 64.89,6.04 J1.B7
RSB-7
  Top 0.2: USB2RS4.B 57.6,20.9 52.2,15.5 52.2,10.37 J1.C2 55.68,8.33 56.52,7.49 56.52,5.84 55.75,5.08 50.1,5.08 49.14,6.04 J1.C7
RSB-8
  Top 0.2: USB2RS8.B 43.46,23.06 36.45,16.05 36.45,10.37 J1.D2 39.8,8.33 40.89,7.24 40.89,5.84 40.13,5.08 34.29,5.08 33.39,5.98 J1.D7

### Text on the board
tPlace: B- | A+ | B- | A+ | +5V | D- | B- | D+ | GND | A+ | B- | A+
tNames: N L | GND | +12V | AC | IN+ | IN- | OUT+ | OUT- | PWR